# Altium schematic sheet Sheet1.SchDoc
size A4
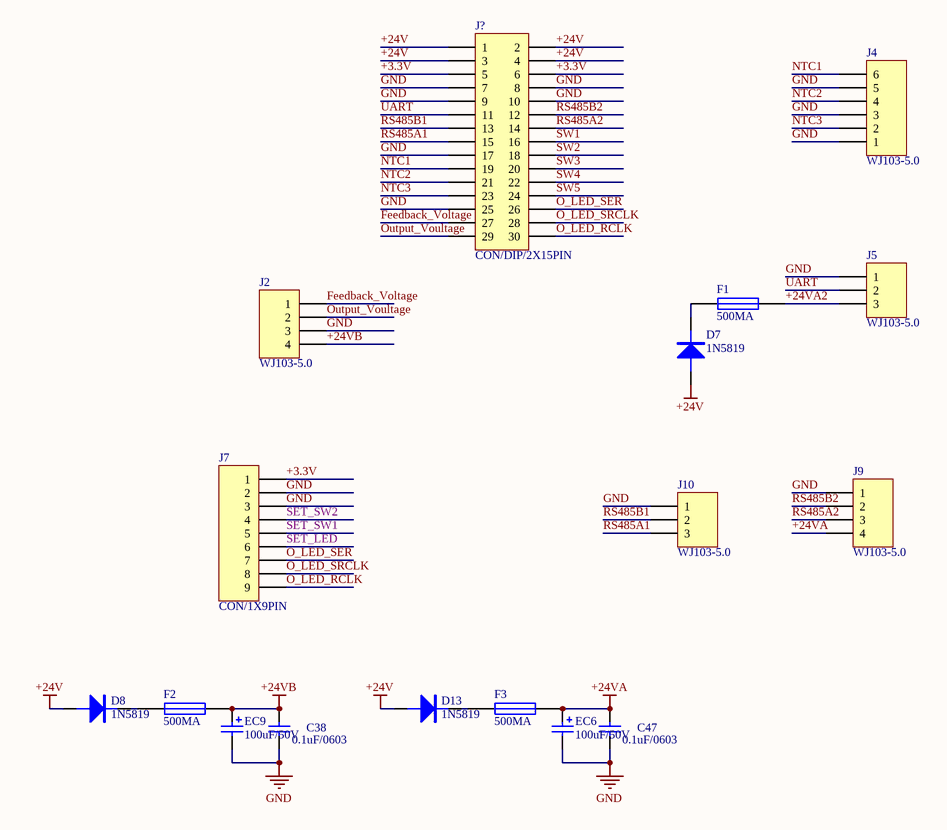
[diagram p0: Sheet1.SchDoc]

## Parts
C38  0.1uF/0603  [CAP/SMT/0603C]
C47  0.1uF/0603  [CAP/SMT/0603C]
D7  1N5819  [D/SMT/DO-214AC]
D8  1N5819  [D/SMT/DO-214AC]
D13  1N5819  [D/SMT/DO-214AC]
EC6  100uF/50V  [CAP/DIP/330UF/25V]
EC9  100uF/50V  [CAP/DIP/330UF/25V]
F1  500MA  [FUSE/100MA/SMC]
F2  500MA  [FUSE/100MA/SMC]
F3  500MA  [FUSE/100MA/SMC]
J2  WJ103-5.0  [CON/DIP/1×4PIN/5.0MM/WJ103-4P]
J4  WJ103-5.0  [CON/DIP/1×6PIN/5.0MM/WJ103-6P]
J5  WJ103-5.0  [CON/DIP/1×3PIN/5.0MM/WJ103-3P]
J7  CON/1X9PIN  [CON/DIP/1X9PIN/ECON9]
J9  WJ103-5.0  [CON/DIP/1×4PIN/5.0MM/WJ103-4P]
J10  WJ103-5.0  [CON/DIP/1×3PIN/5.0MM/WJ103-3P]
J?  CON/DIP/2X15PIN  [CON/DIP/2X15PIN/2.54MM]

## Nets
+24V: D7.2(A) D8.2(A) D13.2(A) J?.1 J?.2 J?.3 J?.4
+24VA: C47.2 EC6.1 F3.2 J9.4
+24VB: C38.2 EC9.1 F2.2 J2.4
GND: C38.1 C47.1 EC6.2 EC9.2 J2.3 J4.1 J4.3 J4.5 J5.1 J7.2 J7.3 J9.1 J10.1 J?.7 J?.8 J?.9 J?.10 J?.17 J?.25
+3.3V: J7.1 J?.5 J?.6
+24VA2: F1.2 J5.3
Feedback_Voltage: J2.1 J?.27
NTC1: J4.6 J?.19
NTC2: J4.4 J?.21
NTC3: J4.2 J?.23
O_LED_RCLK: J7.9 J?.30
O_LED_SER: J7.7 J?.26
O_LED_SRCLK: J7.8 J?.28
Output_Voultage: J2.2 J?.29
RS485A1: J10.3 J?.15
RS485A2: J9.3 J?.14
RS485B1: J10.2 J?.13
RS485B2: J9.2 J?.12
SET_LED: J7.6
SET_SW1: J7.5
SET_SW2: J7.4
SW1: J?.16
SW2: J?.18
SW3: J?.20
SW4: J?.22
SW5: J?.24
UART: J5.2 J?.11
NetD7_1: D7.1(K) F1.1
NetD8_1: D8.1(K) F2.1
NetD13_1: D13.1(K) F3.1

## Library data of the parts
C38 C47 = CAP/CAP/SMT/0603C
D7 = D/D/SMT/1N4007/DO-214
D8 D13 = D/D/SMT/1N5819/DO-214
EC6 EC9 = CAP/AEC/DIP/330uF/25V
F1-F3 = FUSE/PTC/SMT/100MA
J2 J9 = CON/DIP/1X4PIN/WJ103-5.0MM: Connector
J4 = CON/DIP/1X6PIN/WJ103-5.0MM: Connector
J5 J10 = CON/DIP/1X3PIN/WJ103-5.0MM: Connector
J7 = CON/DIP/1X9PIN 线束
J? = CON/DIP/2X15PIN: Connector; LatestRevisionDate: 17-Jul-2002; LatestRevisionNote: Re-released for DXP Platform.; Publisher: Altium Limited